# Altium schematic sheet APP_1_Ethernet.SchDoc
size Tabloid; SheetNumber: 10; SheetTotal: 13; Sheet_Name: Ethernet; Size: 11x17
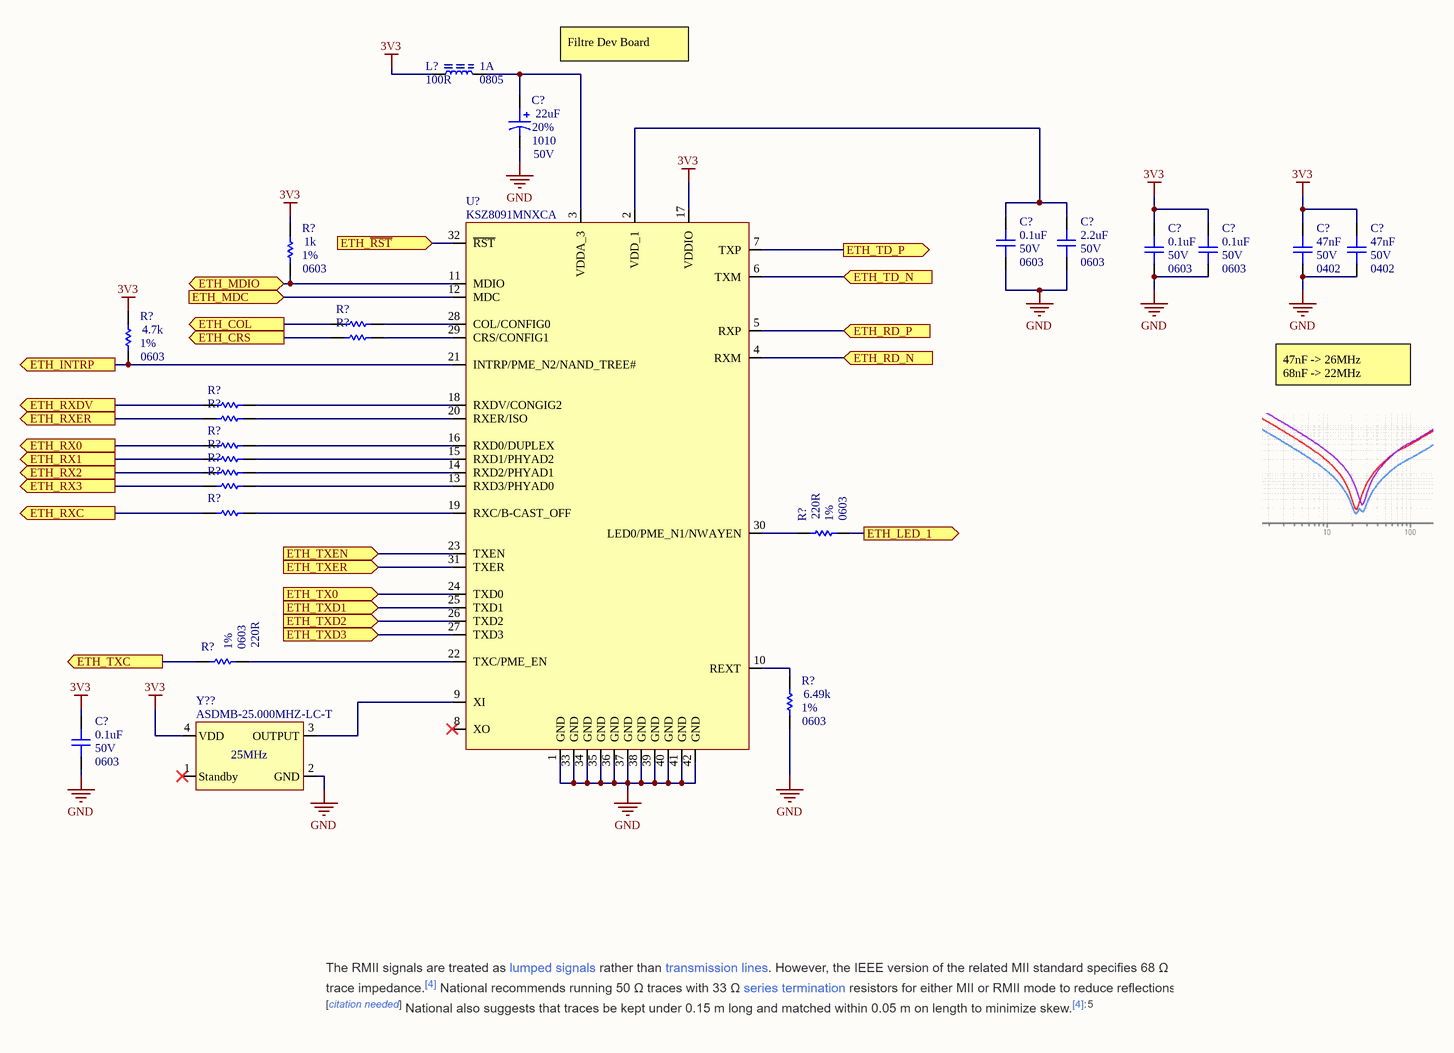
[diagram p0: APP_1_Ethernet.SchDoc]

## Parts
(Parts that share a designator on the sheet are numbered #1, #2 ... from top to bottom, then left to right.)
C?#1  value 22uF  Voltage: 50V  Package: 1010  Precision: 20%  [CAP_ALU_1010_vishay]  (hidden comment: MAL215099101E3)
C?#2  value 0.1uF  Voltage: 50V  Package: 0603  [CAP_0603]  (hidden comment: CAP - 0603)
C?#3  value 2.2uF  Voltage: 50V  Package: 0603  [CAP_0603]  (hidden comment: CAP - 0603)
C?#4  value 0.1uF  Voltage: 50V  Package: 0603  [CAP_0603]  (hidden comment: CAP - 0603)
C?#5  value 0.1uF  Voltage: 50V  Package: 0603  [CAP_0603]  (hidden comment: CAP - 0603)
C?#6  value 47nF  Voltage: 50V  Package: 0402  [CAP_0402]  (hidden comment: CAP - 0402)
C?#7  value 47nF  Voltage: 50V  Package: 0402  [CAP_0402]  (hidden comment: CAP - 0402)
C?#8  value 0.1uF  Voltage: 50V  Package: 0603  [CAP_0603]  (hidden comment: CAP - 0603)
L?  value 100R  Current: 1A  Package: 0805  [FER_0805]  (hidden comment: FER - 0805)
R?#1  value 1k  Package: 0603  Precision: 1%  [RES_0603]  (hidden comment: RES - 0603)
R?#2  RES - 0603  [RES_0603]  (value not drawn)
R?#3  value 4.7k  Package: 0603  Precision: 1%  [RES_0603]  (hidden comment: RES - 0603)
R?#4  RES - 0603  [RES_0603]  (value not drawn)
R?#5  RES - 0603  [RES_0603]  (value not drawn)
R?#6  RES - 0603  [RES_0603]  (value not drawn)
R?#7  RES - 0603  [RES_0603]  (value not drawn)
R?#8  RES - 0603  [RES_0603]  (value not drawn)
R?#9  RES - 0603  [RES_0603]  (value not drawn)
R?#10  RES - 0603  [RES_0603]  (value not drawn)
R?#11  RES - 0603  [RES_0603]  (value not drawn)
R?#12  value 220R  Package: 0603  Precision: 1%  [RES_0603]  (hidden comment: RES - 0603)
R?#13  value 220R  Package: 0603  Precision: 1%  [RES_0603]  (hidden comment: RES - 0603)
R?#14  value 6.49k  Package: 0603  Precision: 1%  [RES_0603]  (hidden comment: RES - 0603)
U?  KSZ8091MNXCA  [COM_ETH_PHY_KSZ8091MNXCA]
Y??  ASDMB-25.000MHZ-LC-T  [OSC_ASDMB-25.000MHZ-LC-T]

## Ports
ETH_COL (out), ETH_CRS (out), ETH_INTRP (out), ETH_LED_1 (out, see APP_1_Connectors_e[4B]), ETH_MDC (in), ETH_MDIO (bidir), ETH_RD_N (in, see APP_1_Connectors_e[5B]), ETH_RD_P (in, see APP_1_Connectors_e[5B]), ETH_RX0 (out), ETH_RX1 (out), ETH_RX2 (out), ETH_RX3 (out), ETH_RXC (out), ETH_RXDV (out), ETH_RXER (out), ETH_TD_N (in, see APP_1_Connectors_e[6B]), ETH_TD_P (out, see APP_1_Connectors_e[6B]), ETH_TX0 (in), ETH_TXC (out), ETH_TXD1 (in), ETH_TXD2 (in), ETH_TXD3 (in), ETH_TXEN (in), ETH_TXER (in), ETH_~{RST} (in)

## Nets
3V3: C?#4.2 C?#5.2 C?#6.2 C?#7.2 C?#8.2 L?.2 R?#1.2 R?#3.2 U?.17(VDDIO) Y??.4(VDD)
GND: C?#1.2 C?#2.1 C?#3.1 C?#4.1 C?#5.1 C?#6.1 C?#7.1 C?#8.1 R?#14.1 U?.1(GND) U?.33(GND) U?.34(GND) U?.35(GND) U?.36(GND) U?.37(GND) U?.38(GND) U?.39(GND) U?.40(GND) U?.41(GND) U?.42(GND) Y??.2(GND)
ETH_COL: R?#2.2 ; port ETH_COL
ETH_CRS: R?#4.2 ; port ETH_CRS
ETH_INTRP: R?#3.1 U?.21(INTRP/PME_N2/NAND_TREE#) ; port ETH_INTRP
ETH_LED_1: R?#12.1 ; port ETH_LED_1
ETH_MDC: U?.12(MDC) ; port ETH_MDC
ETH_MDIO: R?#1.1 U?.11(MDIO) ; port ETH_MDIO
ETH_~{RST}: U?.32(~{RST}) ; port ETH_~{RST}
ETH_RD_N: U?.4(RXM) ; port ETH_RD_N
ETH_RD_P: U?.5(RXP) ; port ETH_RD_P
ETH_RX0: R?#7.2 ; port ETH_RX0
ETH_RX1: R?#8.2 ; port ETH_RX1
ETH_RX2: R?#9.2 ; port ETH_RX2
ETH_RX3: R?#10.2 ; port ETH_RX3
ETH_RXC: R?#11.2 ; port ETH_RXC
ETH_RXDV: R?#5.2 ; port ETH_RXDV
ETH_RXER: R?#6.2 ; port ETH_RXER
ETH_TD_N: U?.6(TXM) ; port ETH_TD_N
ETH_TD_P: U?.7(TXP) ; port ETH_TD_P
ETH_TX0: U?.24(TXD0) ; port ETH_TX0
ETH_TXC: R?#13.2 ; port ETH_TXC
ETH_TXD1: U?.25(TXD1) ; port ETH_TXD1
ETH_TXD2: U?.26(TXD2) ; port ETH_TXD2
ETH_TXD3: U?.27(TXD3) ; port ETH_TXD3
ETH_TXEN: U?.23(TXEN) ; port ETH_TXEN
ETH_TXER: U?.31(TXER) ; port ETH_TXER
NetC?#1_1: C?#1.1 L?.1 U?.3(VDDA_3)
NetC?#2_2: C?#2.2 C?#3.2 U?.2(VDD_1)
NetR?#2_1: R?#2.1 U?.28(COL/CONFIG0)
NetR?#4_1: R?#4.1 U?.29(CRS/CONFIG1)
NetR?#5_1: R?#5.1 U?.18(RXDV/CONGIG2)
NetR?#6_1: R?#6.1 U?.20(RXER/ISO)
NetR?#7_1: R?#7.1 U?.16(RXD0/DUPLEX)
NetR?#8_1: R?#8.1 U?.15(RXD1/PHYAD2)
NetR?#9_1: R?#9.1 U?.14(RXD2/PHYAD1)
NetR?#10_1: R?#10.1 U?.13(RXD3/PHYAD0)
NetR?#11_1: R?#11.1 U?.19(RXC/B-CAST_OFF)
NetR?#12_2: R?#12.2 U?.30(LED0/PME_N1/NWAYEN)
NetR?#13_1: R?#13.1 U?.22(TXC/PME_EN)
NetR?#14_2: R?#14.2 U?.10(REXT)
NetU?_9: U?.9(XI) Y??.3(OUTPUT)

Not connected (* = marked no-connect by the designer): U? 8(XO)*; Y?? 1(Standby)*

## Notes on the sheet
- Filtre Dev Board
- 47nF -> 26MHz
  68nF -> 22MHz
- Sheet Name
- Project Title
- Global Project
- Size
- Group
- Revision
- Date
- Sheet
- of
- Filename
- Designers

## Library data of the parts
C?#1 = CAP_ALU_MAL215099101E3: CAP - ALU 100uF 20% 50V - 1010; Current: 490mA; Mfg: Vishay Dale; Mfg Part Number: MAL215099101E3; HelpURL: http://www.vishay.com/docs/28395/150crz.pdf; CreatedBy: Jonathan Bouchard; Temperature: -55°C to 125°C; Power: *; Supplier 1: Digikey; Supplier Part Number 1: 4399PHDKR-ND
C?#2-C?#5 C?#8 = CAP - 0603: Precision: 10%; Current: *; CreatedBy: Jonathan Bouchard; Power: *
C?#6 C?#7 = CAP - 0402: Precision: 10%; Current: *; CreatedBy: Jonathan Bouchard; Power: *
R?#2 R?#4-R?#11 = RES - 0603: Precision: 1%; Value: 220R; Current: *; CreatedBy: Jonathan Bouchard; Package: 0603
U? = COM_ETH_PHY_KSZ8091MNXCA: COM - ETHERNET PHY 10/100 - QFN-32; Voltage: 1.8V, 2.5V, 3.3V; Mfg: Micrel; Current: *; Power: *; Mfg Part Number: KSZ8091MNXCA; HelpURL: http://ww1.microchip.com/downloads/en/DeviceDoc/00002275A.pdf; CreatedBy: Jonathan Bouchard; Temperature: 0°C ~ 70°C; Value: *; Precision: *; Package: QFN-32; Supplier 1: Digikey; Supplier Part Number 1: 576-4356-ND
Y?? = OSC_ASDMB-25.000MHZ-LC-T: OSC - 25MHz XO (Standard) LVCMOS - 4-SMD, No Lead; Manufacturer #1: Abracon LLC; Tolerance: ±50ppm; Voltage Rating: 1.8V ~ 3.3V; GRAMS Lib Spec: 2.8; Magnetic Material: Unknown; Polarized: Yes; Value: 25MHz; Current Rating: *; Power Max: *; HelpURL: https://abracon.com/Oscillators/ASDMB.pdf; CreatedBy/Date: Joël Lemay 2019-03-29; VerifiedBy: C. Paulin - 29 mai 2019; Temperature: -40°C ~ +85°C; Package: 4-SMD, No Lead; Manufacturer #2: *; Note: *; Assembly Type: SMD; Part Number #2: *; Part Number #1: ASDMB-25.000MHZ-LC-T; Supplier 1: Digi-Key; Supplier Part Number 1: 535-11730-1-ND; Cryo: UNKNOWN
L? = FER - 0805: Voltage: *; CreatedBy: Jonathan Bouchard; Power: *; Precision: *
R?#1 R?#3 R?#12-R?#14 = RES - 0603: Current: *; CreatedBy: Jonathan Bouchard